# EAGLE design twe-lite_promini (EAGLE 7.7.0)
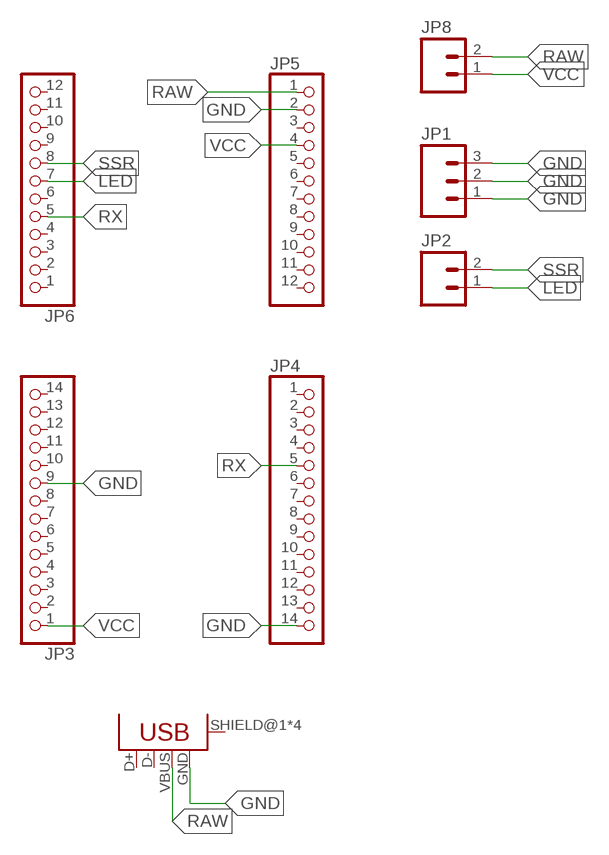
[diagram p0: schematic, sheet 1]

## Parts
JP1  M03PTH  [1X03]
JP2  M02PTH  [1X02]
JP3  PINHD-1X14-CB  [1X14-CB]
JP4  PINHD-1X14-CB  [1X14-CB]
JP5  PINHD-1X12-CB  [1X12-CB]
JP6  PINHD-1X12-CB  [1X12-CB]
JP8  M02PTH  [1X02]
U$1  USB_MINIB  [USB_MINIB]

## Nets
GND: JP1.1 JP1.2 JP1.3 JP3.9 JP4.14 JP5.2 U$1.GND
LED: JP2.1 JP6.7
RAW: JP5.1 JP8.2 U$1.VBUS
RX: JP4.5 JP6.5
SSR: JP2.2 JP6.8
VCC: JP3.1 JP5.4 JP8.1
Unconnected: JP3.2 JP3.3 JP3.4 JP3.5 JP3.6 JP3.7 JP3.8 JP3.10 JP3.11 JP3.12 JP3.13 JP3.14 JP4.1 JP4.2 JP4.3 JP4.4 JP4.6 JP4.7 JP4.8 JP4.9 JP4.10 JP4.11 JP4.12 JP4.13 JP5.3 JP5.5 JP5.6 JP5.7 JP5.8 JP5.9 JP5.10 JP5.11 JP5.12 JP6.1 JP6.2 JP6.3 JP6.4 JP6.6 JP6.9 JP6.10 JP6.11 JP6.12 U$1.D+ U$1.D- U$1.SHIELD@1(SHIELD) U$1.SHIELD@2(SHIELD) U$1.SHIELD@3(SHIELD) U$1.SHIELD@4(SHIELD)

## Library data of the parts
JP1 = 01_SparkFun:M03: Header 3 Standard 3-pin 0.1" header. Use with straight break away headers (SKU : PRT-00116), right angle break away headers (PRT-00553), swiss pins (PRT-00743), machine pins (PRT-00117), and female headers (PRT-00115). Molex polarized connector foot print use with SKU : PRT-08232 with associated crimp pins and housings.
JP2 JP8 = 01_SparkFun:M02: Header 2 Standard 2-pin 0.1" header. Use with straight break away headers (SKU : PRT-00116), right angle break away headers (PRT-00553), swiss pins (PRT-00743), machine pins (PRT-00117), and female headers (PRT-00115). Molex polarized connector foot print use with SKU : PRT-08233 with associated crimp pins and housings.
JP3 JP4 = adafruit:PINHD-1X14: PIN HEADER
JP5 JP6 = adafruit:PINHD-1X12: PIN HEADER
U$1 = fab:USB_MINIB

## Board
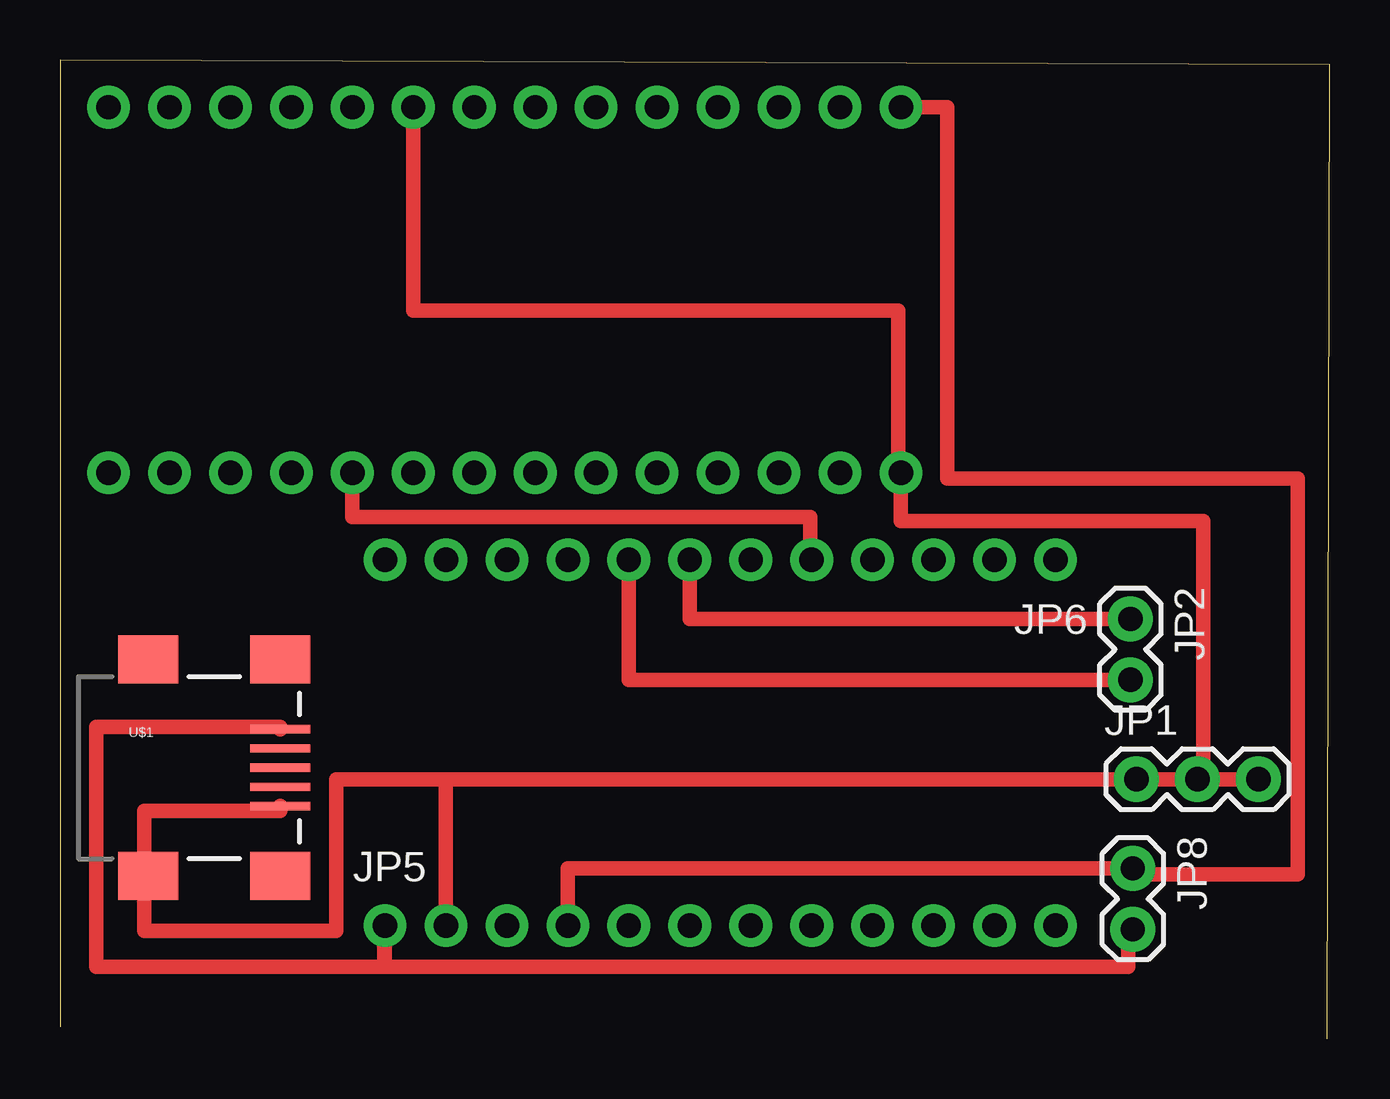
[diagram p1: board, top side]

Size 52.9 x 40.8 mm. Coordinates in mm from the lower left corner, seen from the top.
Outline: 52.8,0 52.9,40.6 0,40.8 0,0.5
Copper layers (1*16): Top 0.035mm / dielectric 1.5mm / Bottom 0.035mm
Design rules "default": minimum track width 10mil, minimum drill 24mil, track to track 8mil, track to pad 8mil, pad to pad 8mil, via to via 8mil, smd to smd 8mil, copper to edge 40mil, drill to drill 8mil, minimum pad ring 10mil, minimum via ring 8mil, stop-mask expansion 4mil, vias tented up to drill 0mil, thermal gap 10mil

### Footprints (pad centres in the part's own frame; a part is rotated, then mirrored left to right if it is on the bottom)
1X03 = drill 1.016 pad 1.88: 1 0,0; 2 2.54,0; 3 5.08,0
1X02 = drill 1.016 pad 1.88: 1 0,0; 2 2.54,0
1X14-CB = drill 1.016 pad 1.778: 1 -16.51,0; 2 -13.97,0; 3 -11.43,0; 4 -8.89,0; 5 -6.35,0; 6 -3.81,0; 7 -1.27,0; 8 1.27,0; 9 3.81,0; 10 6.35,0; 11 8.89,0; 12 11.43,0; 13 13.97,0; 14 16.51,0
1X12-CB = drill 1.016 pad 1.778: 1 -13.97,0; 2 -11.43,0; 3 -8.89,0; 4 -6.35,0; 5 -3.81,0; 6 -1.27,0; 7 1.27,0; 8 3.81,0; 9 6.35,0; 10 8.89,0; 11 11.43,0; 12 13.97,0
USB_MINIB = smd 2.5 x 0.35: D+ 3.77,0; D- 3.77,0.8; GND 3.77,-1.6; ID 3.77,-0.8; VBUS 3.77,1.6 | smd 2.5 x 2: SHIELD@1 -1.73,-4.5; SHIELD@2 -1.73,4.5; SHIELD@3 3.77,4.5; SHIELD@4 3.77,-4.5

### Placement (x,y rotation side)
JP1  44.85,10.82 0 top
JP2  44.6,17.5 270 top
JP3  18.53,38.83 180 top
JP4  18.53,23.59 0 top
JP5  27.51,4.72 0 top
JP6  27.51,19.96 180 top
JP8  44.7,7.1 270 top
U$1  5.4,11.3 0 top

### Tracks (layer width: path | path; a pad name or v marks a point on that pad's centre or on a via)
GND
  Top 0.61: JP5.2 16.08,10.82 | 16.08,10.82 JP1.1 JP1.2 | JP1.2 JP1.3 | JP1.2 47.62,10.82 47.62,21.59 35.04,21.59 JP4.14 34.92,24.09 34.92,30.34 14.72,30.34 JP3.9 | 16.08,10.82 11.5,10.82 11.5,4.5 3.5,4.5 3.5,9.5 9.17,9.5 U$1.GND
LED
  Top 0.61: 26.2,19.92 JP6.7 26.24,17.5 JP2.1
RAW
  Top 0.61: 13.54,4.7 JP5.1 | JP5.1 13.54,3 44.5,3 44.5,4.56 JP8.2 | JP5.1 13.5,4.72 13.5,3 1.5,3 1.5,13 9.17,13 U$1.VBUS
RX
  Top 0.61: JP4.5 12.18,21.75 31.25,21.75 31.25,19.96 JP6.5
SSR
  Top 0.61: JP6.8 23.7,14.96 JP2.2
VCC
  Top 0.61: JP5.4 21.16,7.1 JP8.1 44.7,6.85 51.57,6.85 51.57,23.36 36.97,23.36 36.97,38.83 JP3.1